# Altium schematic sheet Camera_Board.SchDoc
size A4
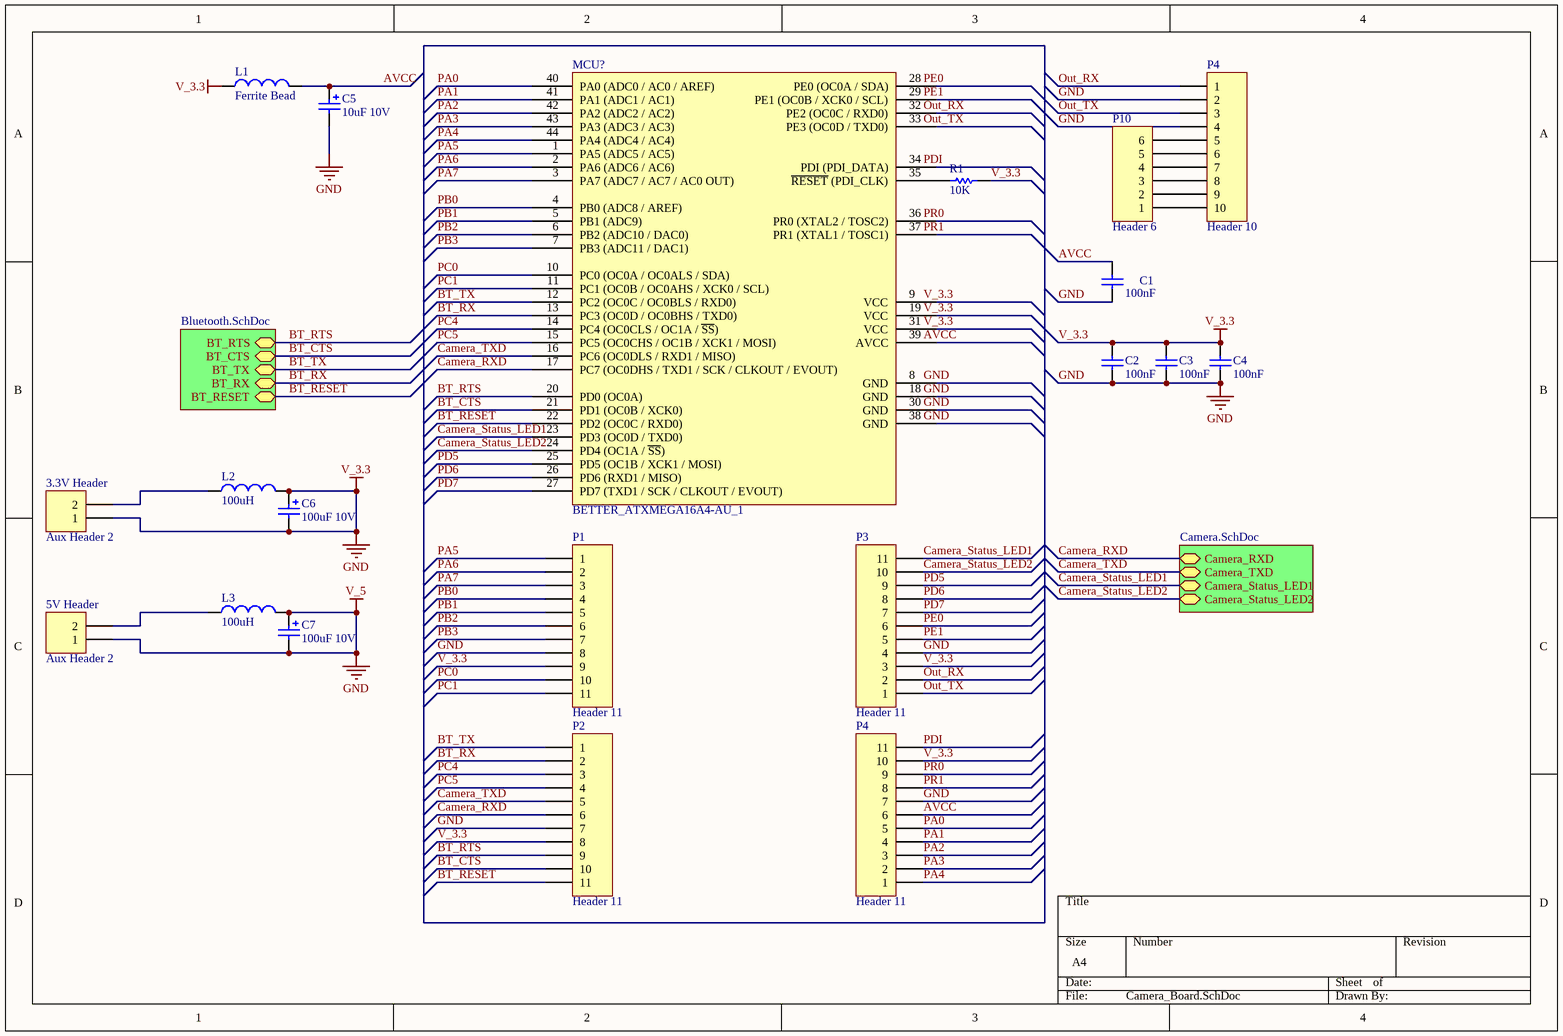
[diagram p0: Camera_Board.SchDoc]

## Parts
(Parts that share a designator on the sheet are numbered #1, #2 ... from top to bottom, then left to right.)
3.3V_Header  Aux Header 2  [TMHDR2]
5V_Header  Aux Header 2  [TMHDR2]
C1  100nF  [CC0603]
C2  100nF  [CC0603]
C3  100nF  [CC0603]
C4  100nF  [CC0603]
C5  10uF 10V  [TANT3216]
C6  100uF 10V  [TANT6032]
C7  100uF 10V  [TANT6032]
L1  Ferrite Bead  [R0805]
L2  100uH  [inductor_B82464-A4]
L3  100uH  [inductor_B82464-A4]
MCU?  BETTER_ATXMEGA16A4-AU_1  [TQFP80P1200X1200X120-44N]
P1  Header 11  [HDR1X11]
P2  Header 11  [HDR1X11]
P3  Header 11  [HDR1X11]
P4#1  Header 10  [HDR1X10]
P4#2  Header 11  [HDR1X11]
P10  Header 6  [HDR1X6]
R1  10K  [R0603]

## Sub-sheets
? = Bluetooth.SchDoc: BT_RX, BT_TX, BT_RTS, BT_CTS, BT_RESET
? = Camera.SchDoc: Camera_RXD, Camera_Status_LED1, Camera_Status_LED2, Camera_TXD

## Nets
GND: 3.3V_Header.?1(1) 5V_Header.?1(1) C1.1 C2.1 C2.2 C3.1 C3.2 C4.1 C4.2 C5.2 C6.1 C6.2 C7.1 C7.2 L1.1 L2.2 L3.2 P1.8 P1.9 P2.7 P2.8 P3.3 P3.4 P4#1.2 P4#1.4 P4#2.7 P4#2.10 R1.2  [also labelled V_3.3, V_5]
AVCC: C1.2 C5.1 L1.2 P4#2.6
BT_CTS: MCU?.21(PD1_(OC0B_/_XCK0)) P2.10 ; sheet /BT_CTS
BT_RESET: MCU?.22(PD2_(OC0C_/_RXD0)) P2.11 ; sheet /BT_RESET
BT_RTS: MCU?.20(PD0_(OC0A)) P2.9 ; sheet /BT_RTS
BT_RX: MCU?.13(PC3_(OC0D_/_OC0BHS_/_TXD0)) P2.2 ; sheet /BT_RX
BT_TX: MCU?.12(PC2_(OC0C_/_OC0BLS_/_RXD0)) P2.1 ; sheet /BT_TX
Camera_RXD: MCU?.17(PC7_(OC0DHS_/_TXD1_/_SCK_/_CLKOUT_/_EVOUT)) P2.6 ; sheet /Camera_RXD
Camera_Status_LED1: MCU?.23(PD3_(OC0D_/_TXD0)) P3.11 ; sheet /Camera_Status_LED1
Camera_Status_LED2: MCU?.24(PD4_(OC1A_/_~{SS})) P3.10 ; sheet /Camera_Status_LED2
Camera_TXD: MCU?.16(PC6_(OC0DLS_/_RXD1_/_MISO)) P2.5 ; sheet /Camera_TXD
Out_RX: P3.2 P4#1.1
Out_TX: P3.1 P4#1.3
PA0: MCU?.40(PA0_(ADC0_/_AC0_/_AREF)) P4#2.5
PA1: MCU?.41(PA1_(ADC1_/_AC1)) P4#2.4
PA2: MCU?.42(PA2_(ADC2_/_AC2)) P4#2.3
PA3: MCU?.43(PA3_(ADC3_/_AC3)) P4#2.2
PA4: MCU?.44(PA4_(ADC4_/_AC4)) P4#2.1
PA5: MCU?.1(PA5_(ADC5_/_AC5)) P1.1
PA6: MCU?.2(PA6_(ADC6_/_AC6)) P1.2
PA7: MCU?.3(PA7_(ADC7_/_AC7_/_AC0_OUT)) P1.3
PB0: MCU?.4(PB0_(ADC8_/_AREF)) P1.4
PB1: MCU?.5(PB1_(ADC9)) P1.5
PB2: MCU?.6(PB2_(ADC10_/_DAC0)) P1.6
PB3: MCU?.7(PB3_(ADC11_/_DAC1)) P1.7
PC0: MCU?.10(PC0_(OC0A_/_OC0ALS_/_SDA)) P1.10
PC1: MCU?.11(PC1_(OC0B_/_OC0AHS_/_XCK0_/_SCL)) P1.11
PC4: MCU?.14(PC4_(OC0CLS_/_OC1A_/_~{SS})) P2.3
PC5: MCU?.15(PC5_(OC0CHS_/_OC1B_/_XCK1_/_MOSI)) P2.4
PD5: MCU?.25(PD5_(OC1B_/_XCK1_/_MOSI)) P3.9
PD6: MCU?.26(PD6_(RXD1_/_MISO)) P3.8
PD7: MCU?.27(PD7_(TXD1_/_SCK_/_CLKOUT_/_EVOUT)) P3.7
PDI: P4#2.11
PE0: P3.6
PE1: P3.5
PR0: P4#2.9
PR1: P4#2.8
Net3.3V_Header_?2: 3.3V_Header.?2(2) L2.1
Net5V_Header_?2: 5V_Header.?2(2) L3.1
NetMCU?_35: MCU?.35(~{RESET}_(PDI_CLK)) R1.1
NetP4#1_5: P4#1.5 P10.6
NetP4#1_6: P4#1.6 P10.5
NetP4#1_7: P4#1.7 P10.4
NetP4#1_8: P4#1.8 P10.3
NetP4#1_9: P4#1.9 P10.2
NetP4#1_10: P4#1.10 P10.1

Not connected (* = marked no-connect by the designer): MCU? 8(GND) 9(VCC) 18(GND) 19(VCC) 28(PE0_(OC0A_/_SDA)) 29(PE1_(OC0B_/_XCK0_/_SCL)) 30(GND) 31(VCC) 32(PE2_(OC0C_/_RXD0)) 33(PE3_(OC0D_/_TXD0)) 34(PDI_(PDI_DATA)) 36(PR0_(XTAL2_/_TOSC2)) 37(PR1_(XTAL1_/_TOSC1)) 38(GND) 39(AVCC)

## Notes on the sheet
- Labels drawn without touching a wire or pin: AVCC, GND, Out_RX, Out_TX, PDI, PE0, PE1, PR0, PR1, V_3.3

## Library data of the parts
3.3V_Header 5V_Header = Aux Header 2: 5.08mm Pluggable Terminal Header; LatestRevisionDate: 17-Jul-2002; LatestRevisionNote: Re-released for DXP Platform.; Publisher: Altium Limited
C1-C4 = 100nF_CC0603: 0603 Capacitor; Supplier_Component_Code: RC-P100; published: 28/03/2007 10:54:57 a.m.; Supplier_Name: Soanar Plus; price: 0.09; value: 100nF; Part Number: 100nF_CC0603; Component Kind: Standard; Component Type: Standard; Designator: 100nF_CC0603; Pin Count: 2
C5 = TANT10uF_10V_3216: SM Tantalum Cap; Supplier_Component_Code: RZ-6550; published: 12/03/2007 11:34:36 a.m.; Supplier_Name: Soanar Plus; price: 1.7; value: 10uF 10V; Part Number: TANT10uF_10V_3216; Component Kind: Standard; Component Type: Standard; Designator: TANT10uF_10V_3216; Pin Count: 2
C6 C7 = TANT100uF_10V_6032: SM Tantalum Cap; Supplier_Component_Code: RZ-6556; published: 12/03/2007 11:34:36 a.m.; Supplier_Name: Soanar Plus; price: 5.45; value: 100uF 10V; Part Number: TANT100uF_10V_6032; Component Kind: Standard; Component Type: Standard; Designator: TANT100uF_10V_6032; Pin Count: 2
L1 = L805: Ferrite Bead Inductor; Value: 100R; Published: 8-Jun-2000; LatestRevisionDate: 17-Jul-2002; Publisher: Altium Limited; price: 0.11; Supplier_Component_Code: LF-P308; Supplier_Name: Soanar Plus; Part Number: L805; Component Kind: Standard; Component Type: Standard; Designator: L805; Pin Count: 2; Signal Integrity: Inductor; Simulation: INDUCTOR
L2 L3 = B82464A4104K: INDUCTOR POWER 100UH 1.03A SMD; ECE_Component_Code: B82464A4104K; value: 100uH; Supplier_Component_Code: 495-2003-1-ND; published: 11/06/2007; Supplier_Name: Digikey; price: 1.54; Part Number: B82464A4104K; Component Kind: Standard; Component Type: Standard; Designator: B82464A4104K; Pin Count: 2
P1-P3 P4#2 = Header 11: Header, 11-Pin; LatestRevisionDate: 17-Jul-2002; LatestRevisionNote: Re-released for DXP Platform.; Publisher: Altium Limited
P4#1 = Header 10: Header, 10-Pin; LatestRevisionDate: 17-Jul-2002; LatestRevisionNote: Re-released for DXP Platform.; Publisher: Altium Limited
P10 = Header 6: Header, 6-Pin; LatestRevisionDate: 17-Jul-2002; LatestRevisionNote: Re-released for DXP Platform.; Publisher: Altium Limited
R1 = 10K_R0603: 0603 Resistor; ECE_Component_Code: 10K_R0603; value: 10K; Supplier_Component_Code: RS-S097; published: 12/03/2007 11:34:34 a.m.; Supplier_Name: Soanar Plus; price: 0.08; Part Number: 10K_R0603; Component Kind: Standard; Component Type: Standard; Designator: 10K_R0603; Pin Count: 2